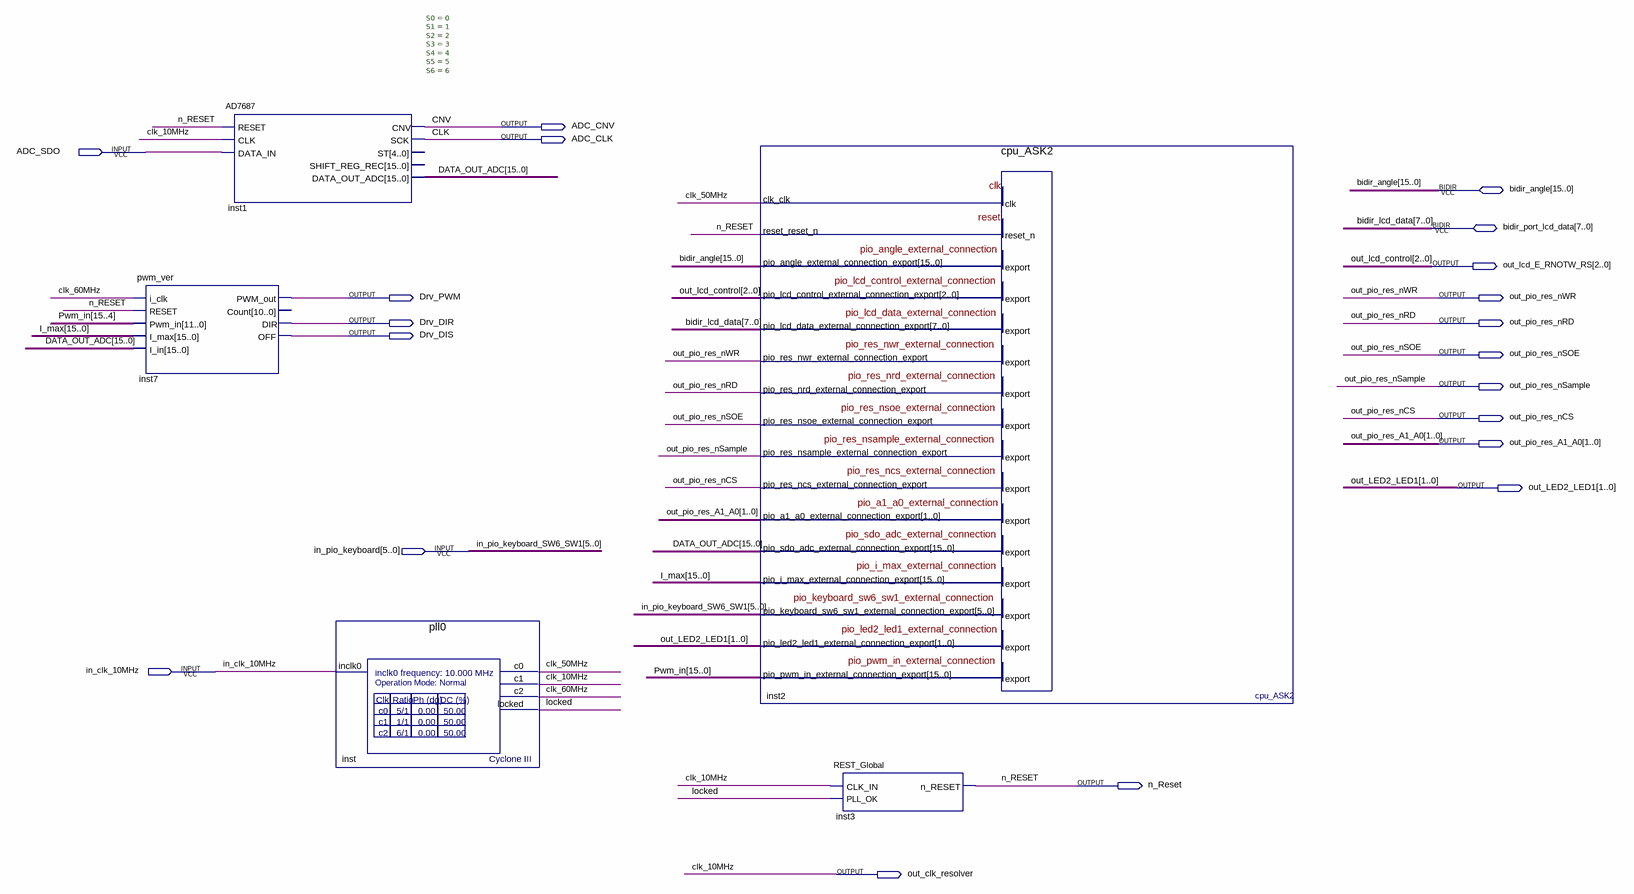
[diagram p0: schematic sheet]
// Quartus schematic Controller_ASK2.bdf as structural Verilog: 5 symbols, 20 pins
module Controller_ASK2 (
  input  ADC_SDO,
  input  [5:0] in_pio_keyboard,
  input  in_clk_10MHz,
  inout  [15:0] bidir_angle,
  inout  [7:0] bidir_port_lcd_data,
  output ADC_CNV,
  output ADC_CLK,
  output [2:0] out_lcd_E_RNOTW_RS,
  output Drv_PWM,
  output out_pio_res_nWR,
  output Drv_DIR,
  output out_pio_res_nRD,
  output Drv_DIS,
  output out_pio_res_nSOE,
  output out_pio_res_nSample,
  output out_pio_res_nCS,
  output [1:0] out_pio_res_A1_A0,
  output [1:0] out_LED2_LED1,
  output n_Reset,
  output out_clk_resolver
);

  wire clk_50MHz, clk_60MHz, locked;
  wire [15:0] DATA_OUT_ADC, I_max, Pwm_in;

  pwm_ver inst7 (
    .i_clk(clk_60MHz), .RESET(n_Reset), .Pwm_in(Pwm_in[15:4]), .I_max(I_max), .I_in(DATA_OUT_ADC),
    .PWM_out(Drv_PWM), .DIR(Drv_DIR), .OFF(Drv_DIS));  // open: Count
  AD7687 #(.S0(0), .S1(1), .S2(2), .S3(3), .S4(4), .S5(5), .S6(6)) inst1 (
    .RESET(n_Reset), .CLK(out_clk_resolver), .DATA_IN(ADC_SDO), .CNV(ADC_CNV), .SCK(ADC_CLK),
    .DATA_OUT_ADC(DATA_OUT_ADC));  // open: ST, SHIFT_REG_REC
  pll0 inst (.inclk0(in_clk_10MHz), .c0(clk_50MHz), .c1(out_clk_resolver), .c2(clk_60MHz), .locked(locked));
  cpu_ASK2 inst2 (
    .clk_clk(clk_50MHz), .reset_reset_n(n_Reset), .pio_sdo_adc_external_connection_export(DATA_OUT_ADC),
    .pio_keyboard_sw6_sw1_external_connection_export(in_pio_keyboard),
    .pio_lcd_control_external_connection_export(out_lcd_E_RNOTW_RS),
    .pio_res_nwr_external_connection_export(out_pio_res_nWR),
    .pio_res_nrd_external_connection_export(out_pio_res_nRD),
    .pio_res_nsample_external_connection_export(out_pio_res_nSample),
    .pio_res_ncs_external_connection_export(out_pio_res_nCS),
    .pio_a1_a0_external_connection_export(out_pio_res_A1_A0), .pio_i_max_external_connection_export(I_max),
    .pio_led2_led1_external_connection_export(out_LED2_LED1), .pio_pwm_in_external_connection_export(Pwm_in),
    .pio_angle_external_connection_export(bidir_angle),
    .pio_lcd_data_external_connection_export(bidir_port_lcd_data),
    .pio_res_nsoe_external_connection_export(out_pio_res_nSOE));
  REST_Global inst3 (.CLK_IN(out_clk_resolver), .PLL_OK(locked), .n_RESET(n_Reset));

  // Other names for the same wires on the sheet: bidir_lcd_data[7:0] = bidir_port_lcd_data; CLK = ADC_CLK;
  //   clk_10MHz = out_clk_resolver; CNV = ADC_CNV; in_pio_keyboard_SW6_SW1[5:0] = in_pio_keyboard;
  //   out_lcd_control[2:0] = out_lcd_E_RNOTW_RS
endmodule
